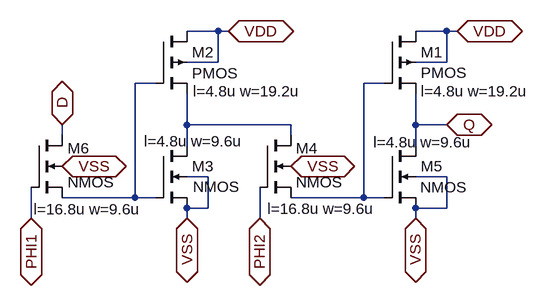
[diagram p0: schematic Shift_Register.asc]
Shift_Register.asc, the LTspice schematic file:
Version 4
SHEET 1 880 680
WIRE -112 48 -160 48
WIRE -96 48 -112 48
WIRE 240 48 192 48
WIRE 256 48 240 48
WIRE -112 96 -112 48
WIRE -112 96 -160 96
WIRE 240 96 240 48
WIRE 240 96 192 96
WIRE -208 128 -240 128
WIRE 144 128 112 128
WIRE -160 192 -160 144
WIRE 0 192 -160 192
WIRE 192 192 192 144
WIRE 240 192 192 192
WIRE -352 208 -352 192
WIRE 0 208 0 192
WIRE -160 224 -160 192
WIRE 192 224 192 192
WIRE -128 272 -160 272
WIRE 240 272 192 272
WIRE -240 304 -240 128
WIRE -240 304 -352 304
WIRE -208 304 -240 304
WIRE 112 304 112 128
WIRE 112 304 0 304
WIRE 144 304 112 304
WIRE -128 320 -128 272
WIRE -128 320 -160 320
WIRE 240 320 240 272
WIRE 240 320 192 320
WIRE -400 336 -400 288
WIRE -160 336 -160 320
WIRE -48 336 -48 288
WIRE 192 336 192 320
FLAG -400 336 PHI1
IOPIN -400 336 BiDir
FLAG -48 336 PHI2
IOPIN -48 336 BiDir
FLAG -352 192 D
IOPIN -352 192 BiDir
FLAG -96 48 VDD
IOPIN -96 48 BiDir
FLAG 256 48 VDD
IOPIN 256 48 BiDir
FLAG -160 336 VSS
IOPIN -160 336 BiDir
FLAG 192 336 VSS
IOPIN 192 336 BiDir
FLAG 240 192 Q
IOPIN 240 192 BiDir
FLAG -352 256 VSS
IOPIN -352 256 BiDir
FLAG 0 256 VSS
IOPIN 0 256 BiDir
SYMBOL pmos4 144 48 R0
WINDOW 123 56 92 Left 2
WINDOW 3 56 64 Left 2
SYMATTR Value2 l=4.8u w=19.2u
SYMATTR InstName M1
SYMBOL pmos4 -208 48 R0
WINDOW 123 57 92 Left 2
WINDOW 3 56 65 Left 2
SYMATTR Value2 l=4.8u w=19.2u
SYMATTR InstName M2
SYMBOL nmos4 -208 224 R0
WINDOW 123 -18 -7 Left 2
WINDOW 3 57 63 Left 2
SYMATTR Value2 l=4.8u w=9.6u
SYMATTR InstName M3
SYMBOL nmos4 -48 208 R0
WINDOW 123 12 113 Left 2
WINDOW 0 56 20 Left 2
SYMATTR Value2 l=16.8u w=9.6u
SYMATTR InstName M4
SYMBOL nmos4 144 224 R0
WINDOW 123 -17 -5 Left 2
WINDOW 3 55 64 Left 2
SYMATTR Value2 l=4.8u w=9.6u
SYMATTR InstName M5
SYMBOL nmos4 -400 208 R0
WINDOW 123 4 114 Left 2
WINDOW 0 56 20 Left 2
SYMATTR Value2 l=16.8u w=9.6u
SYMATTR InstName M6

The netlist it stands for:
* Shift_Register.asc
M1 VDD N002 Q VDD PMOS l=4.8u w=19.2u
M2 VDD N001 N003 VDD PMOS l=4.8u w=19.2u
M3 N003 N001 VSS VSS NMOS l=4.8u w=9.6u
M4 N003 PHI2 N002 VSS NMOS l=16.8u w=9.6u
M5 Q N002 VSS VSS NMOS l=4.8u w=9.6u
M6 D PHI1 N001 VSS NMOS l=16.8u w=9.6u
.model NMOS NMOS
.model PMOS PMOS
.lib standard.mos
.backanno
.end